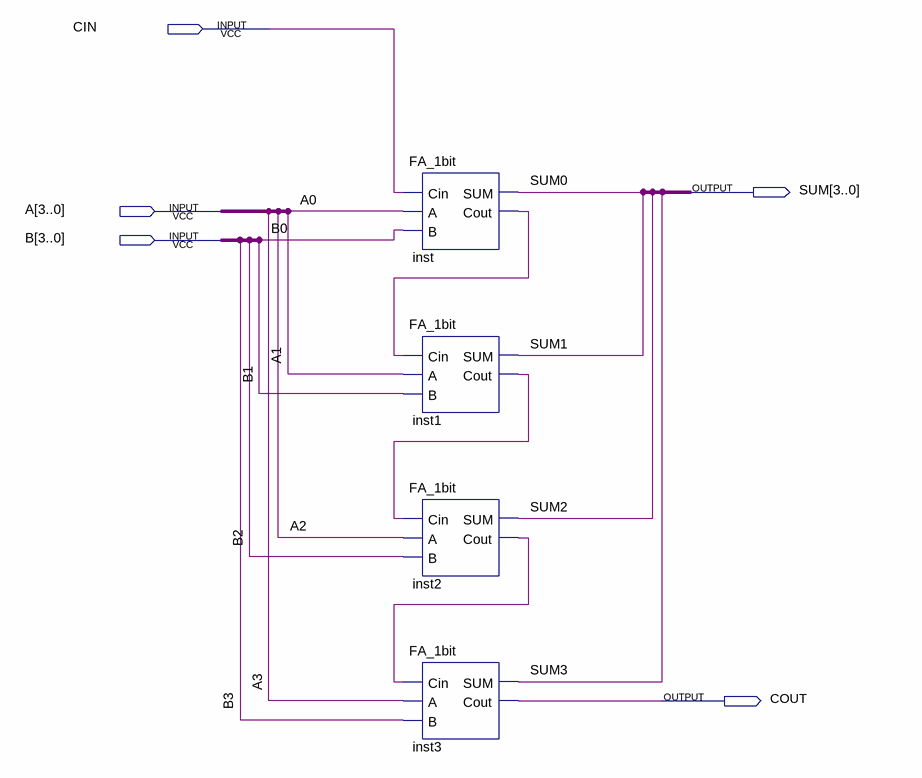
[diagram p0: schematic sheet]
// Quartus schematic FA_4bits.bdf as structural Verilog: 4 symbols, 5 pins
module FA_4bits (
  input  CIN,
  input  [3:0] A,
  input  [3:0] B,
  output [3:0] SUM,
  output COUT
);

  wire inst1_cout, inst2_cout, inst_cout;

  FA_1bit inst (.Cin(CIN), .A(A[0]), .B(B[0]), .SUM(SUM[0]), .Cout(inst_cout));
  FA_1bit inst1 (.Cin(inst_cout), .A(A[1]), .B(B[1]), .SUM(SUM[1]), .Cout(inst1_cout));
  FA_1bit inst2 (.Cin(inst1_cout), .A(A[2]), .B(B[2]), .SUM(SUM[2]), .Cout(inst2_cout));
  FA_1bit inst3 (.Cin(inst2_cout), .A(A[3]), .B(B[3]), .SUM(SUM[3]), .Cout(COUT));
endmodule
